# EasyEDA Pro project 一体板.epro, board PCB5
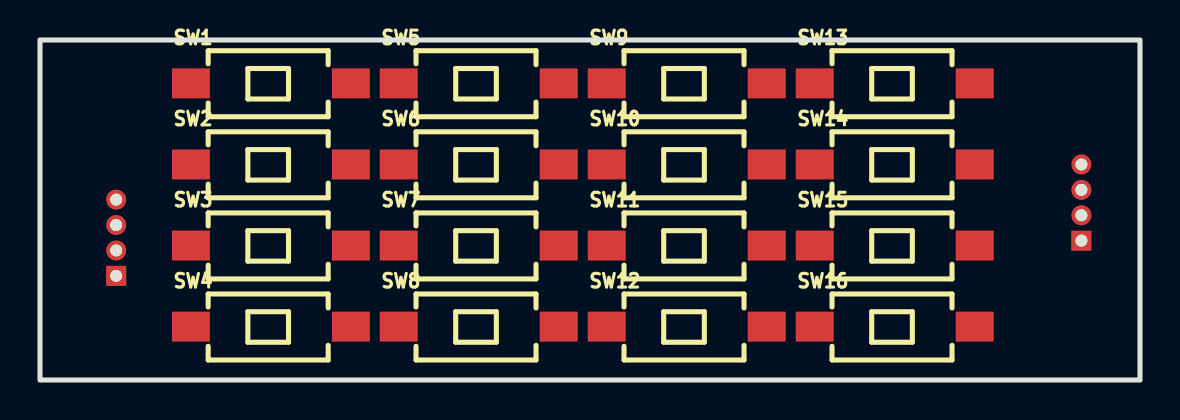
[diagram p13: board, top side]
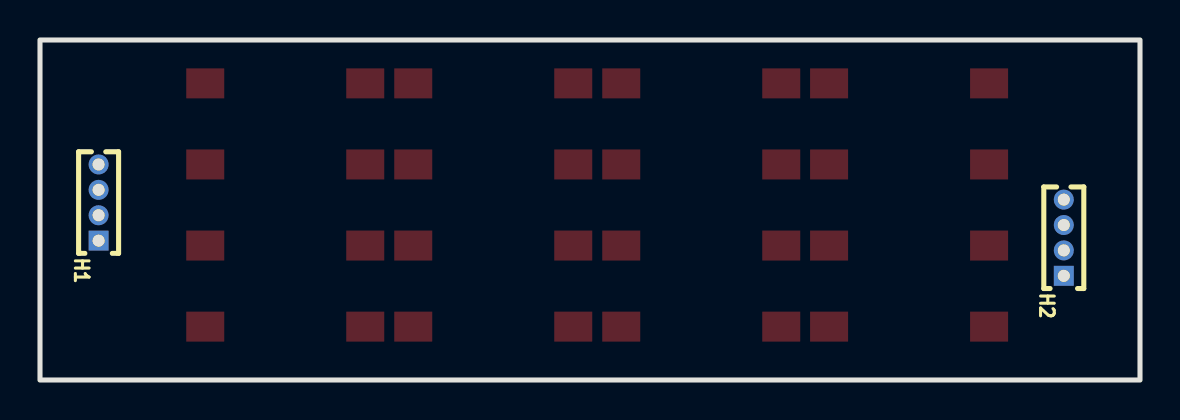
[diagram p14: board, bottom side, seen from below]

Outline 55 x 17 mm; copper layers: Top Layer, Inner3, Inner4, Inner5, Inner6, Inner7, Inner8, Inner9, Inner10, Inner11, Inner12, Inner13, Inner14, Inner15, Inner16, Inner17, Inner18, Inner19, Inner20, Inner21, Inner22, Inner23, Inner24, Inner25, Inner26, Inner27, Inner28, Inner29, Inner30, Bottom Layer. Coordinates in mm from the lower left corner of the outline.
Outline path: rectangle 0,17 55,0
Stack: Top Layer 0.035mm / Dielectric1 1.51mm FR4 er 4.5 / Bottom Layer 0.035mm

## Design rules (mm)
template: JLCPCB Capability(Two Layers Board)
spacing copperThickness1oz (default): track to track 0.102, other pairs 0.152 to 0.3
spacing copperThickness2oz: track to track 0.203, other pairs 0.152 to 0.3
track width copperThickness1oz (default): min 0.127, default 0.254, max 2.54
track width copperThickness2oz: min 0.203, default 0.254, max 2.54
differential pair differentialPair (default): width min 0.127, default 0.254, max 2.54; gap min 0.152, default 0.152
via viaSize (default): diameter min 0.5, default 0.61, max 10; hole min 0.3, default 0.305, max 6.3

## Placement (name value [footprint] x y rotation side)
H1  PZ127V-11-04-0720  [HDR-TH_4P-P1.27-V-M]  52.07 8.87 90 bottom
H2  PZ127V-11-04-0720  [HDR-TH_4P-P1.27-V-M]  3.81 7.11 90 bottom
SW1  TS-1101-C-W  [SW-SMD_L6.0-W3.3-LS8.0]  11.55 14.83 0 top
SW2  TS-1101-C-W  [SW-SMD_L6.0-W3.3-LS8.0]  11.55 10.78 0 top
SW3  TS-1101-C-W  [SW-SMD_L6.0-W3.3-LS8.0]  11.55 6.72 0 top
SW4  TS-1101-C-W  [SW-SMD_L6.0-W3.3-LS8.0]  11.55 2.67 0 top
SW5  TS-1101-C-W  [SW-SMD_L6.0-W3.3-LS8.0]  21.94 14.83 0 top
SW6  TS-1101-C-W  [SW-SMD_L6.0-W3.3-LS8.0]  21.94 10.78 0 top
SW7  TS-1101-C-W  [SW-SMD_L6.0-W3.3-LS8.0]  21.94 6.72 0 top
SW8  TS-1101-C-W  [SW-SMD_L6.0-W3.3-LS8.0]  21.94 2.67 0 top
SW9  TS-1101-C-W  [SW-SMD_L6.0-W3.3-LS8.0]  32.34 14.83 0 top
SW10  TS-1101-C-W  [SW-SMD_L6.0-W3.3-LS8.0]  32.34 10.78 0 top
SW11  TS-1101-C-W  [SW-SMD_L6.0-W3.3-LS8.0]  32.34 6.72 0 top
SW12  TS-1101-C-W  [SW-SMD_L6.0-W3.3-LS8.0]  32.34 2.67 0 top
SW13  TS-1101-C-W  [SW-SMD_L6.0-W3.3-LS8.0]  42.74 14.83 0 top
SW14  TS-1101-C-W  [SW-SMD_L6.0-W3.3-LS8.0]  42.74 10.78 0 top
SW15  TS-1101-C-W  [SW-SMD_L6.0-W3.3-LS8.0]  42.74 6.72 0 top
SW16  TS-1101-C-W  [SW-SMD_L6.0-W3.3-LS8.0]  42.74 2.67 0 top

## Footprints (pads in the part's own frame, mm; a bottom-side part is the same pattern mirrored in y, then rotated)
HDR-TH_4P-P1.27-V-M
  rect 1x1 hole 0.6: 1(-1.905,0)
  round 1 hole 0.6: 2(-0.635,0) 3(0.635,0) 4(1.905,0)
SW-SMD_L6.0-W3.3-LS8.0
  rect 1.9x1.5 smd: 1(-4,0) 2(4,0)

## Nets
As in the schematic.

Pads without a net: H1 1 2 3 4; H2 1 2 3 4
